# Altium schematic sheet Multiplier_x5.SchDoc
size A4; SheetNumber: 12; SheetTotal: 12
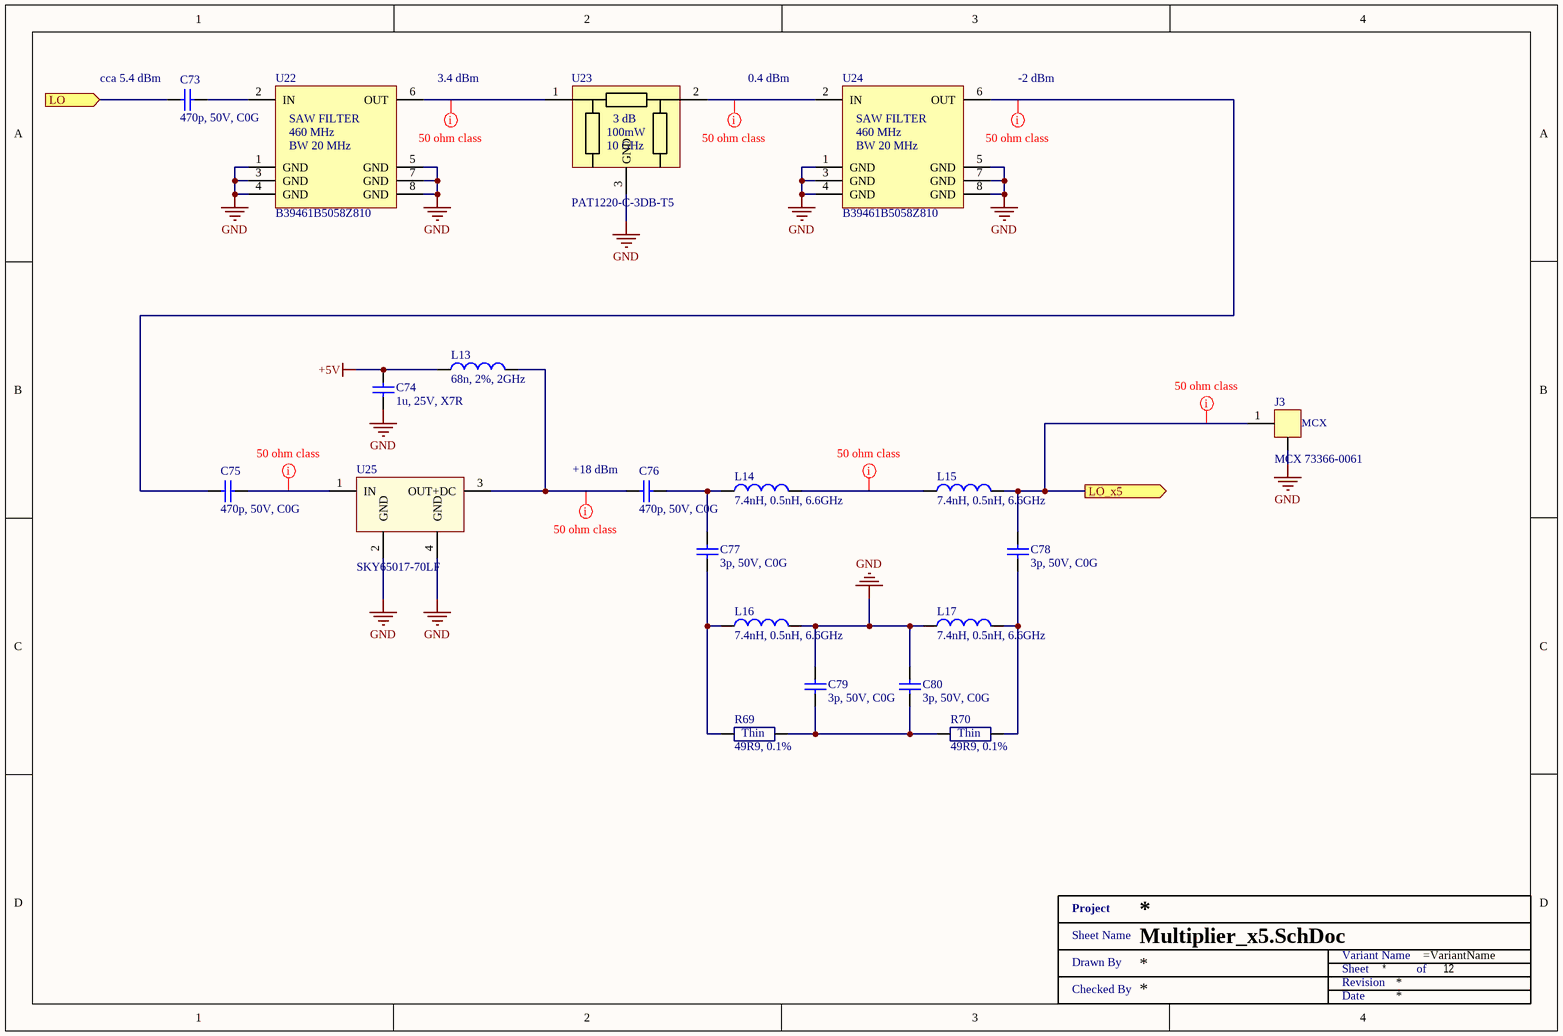
[diagram p0: Multiplier_x5.SchDoc]

## Parts
C73  470p, 50V, C0G  [SMD0603]
C74  1u, 25V, X7R  [SMD0603]
C75  470p, 50V, C0G  [SMD0603]
C76  470p, 50V, C0G  [SMD0603]
C77  3p, 50V, C0G  [SMD0402]
C78  3p, 50V, C0G  [SMD0402]
C79  3p, 50V, C0G  [SMD0402]
C80  3p, 50V, C0G  [SMD0402]
J3  MCX 73366-0061  [73366-0061]
L13  68n, 2%, 2GHz  [SMD0603 - L]
L14  7.4nH, 0.5nH, 6.6GHz  [Coilcraft-0402DC]
L15  7.4nH, 0.5nH, 6.6GHz  [Coilcraft-0402DC]
L16  7.4nH, 0.5nH, 6.6GHz  [Coilcraft-0402DC]
L17  7.4nH, 0.5nH, 6.6GHz  [Coilcraft-0402DC]
R69  49R9, 0.1%  [SMD0402 - R]
R70  49R9, 0.1%  [SMD0402 - R]
U22  B39461B5058Z810  [QCC8B]
U23  PAT1220-C-3DB-T5  [PAT1220]
U24  B39461B5058Z810  [QCC8B]
U25  SKY65017-70LF  [SOT89]
XX?  Title 1  (value not drawn)  (graphical)

## Ports
LO (in), LO_x5 (out)

## Nets
+5V: C74.2 L13.1
GND: C74.1 C79.2 C80.2 J3.2(GND) L16.2 L17.1 U22.1(GND) U22.3(GND) U22.4(GND) U22.5(GND) U22.7(GND) U22.8(GND) U23.3(GND) U24.1(GND) U24.3(GND) U24.4(GND) U24.5(GND) U24.7(GND) U24.8(GND) U25.2(GND) U25.4(GND)
LO: C73.1 ; port LO
LO_x5: C78.2 J3.1(INPUT) L15.2 ; port LO_x5
NetC73_2: C73.2 U22.2(IN)
NetC75_1: C75.1 U24.6(OUT)
NetC75_2: C75.2 U25.1(IN)
NetC76_1: C76.1 L13.2 U25.3(OUT+DC)
NetC76_2: C76.2 C77.2 L14.1
NetC77_1: C77.1 L16.1 R69.1
NetC78_1: C78.1 L17.2 R70.2
NetC79_1: C79.1 C80.1 R69.2 R70.1
NetL14_2: L14.2 L15.1
NetU22_6: U22.6(OUT) U23.1
NetU23_2: U23.2 U24.2(IN)

## Layout directives
net class 50 ohm: LO_x5, NetC75_1, NetC75_2, NetC76_1, NetL14_2, NetU22_6, NetU23_2

## Notes on the sheet
- (near C73) cca 5.4 dBm
- (near U22) 3.4 dBm
- 0.4 dBm
- -2 dBm
- (near C76) +18 dBm
- (in symbol AT0402BRD0749R9L) Thin
- (in symbol B39461B5058Z810) SAW FILTER; 460 MHz; BW 20 MHz
- (in symbol PAT1220-C-3DB-T5) 3 dB; 10 GHz
- (in symbol Title 1) Project; Sheet Name; Variant Name; Drawn By; Sheet; of; Revision; Checked By; Date

## Library data of the parts
C73 C75 C76 = GCM1885C1H471JA16D: MURATA - GCM1885C1H471JA16D - CAP, MLCC, C0G/NP0, 470PF, 50V, 0603; Ceramic Capacitor Case: 0603 [1608 Metric]; Voltage Rating: 50; Capacitance Tolerance: ± 5%; Product Range: GCM Series; SVHC: No SVHC (17-Dec-2015)<!--FANDB--><div class="features-and-benefits-container"><div class="features-and-benefits-desc-container"><span class="features-and-benefits-container-desc">SMD Multilayer Ceramic Capacitor, 0603 [1608 Metric], 470 pF, 50 V, ± 5%, C0G / NP0, GCM Series</span></div><div class="features-and-benefits-description"><span class="features-benefits-value">The GCM series capacitors from Murata are automotive grade multilayer ceramic chip capacitors (MLCC) used for automotive applications such as power train and safety equipment. The safety equipment includes drive system control, air bags and ABS of engine ECU. These MLCC capacitors are classified into temperature compensating and high dielectric constant types depending on the change in electrostatic capacitance due to change in temperature. The temperature compensating capacitors feature a small rate of change in electrostatic capacitance as the temperature changes. The high dielectric constant capacitors use materials with a high dielectric constant and feature a large electrostatic capacitance.</span></div><div class="features-and-benefits-list"><ul class="features-and-benefits-list-list"><li class="features-and-benefits-list-item">Capacitance values ranges from 0.1pF to 47?F</li><li class="features-and-benefits-list-item">Large capacity and small size in a multilayer structure</li><li class="features-and-benefits-list-item">Tin plated external electrodes, excellent solderability</li><li class="features-and-benefits-list-item">Capacitor size varies from 0.6mm x 0.3mm to 5.7mm x 5.0mm</li><li class="features-and-benefits-list-item">Voltage rating ranges from 6.3VDC to 1000VDC</li><li class="features-and-benefits-list-item">Temperature characteristics are classified according to JIS and EIA standard</li><li class="features-and-benefits-list-item">Operating temperature changes according to temperature coefficient of capacitor</li><li class="features-and-benefits-list-item">Automotive grade AEC-Q200 qualified</li></ul></div><div class="features-and-benefits-applications"><ul class="features-and-benefits-value"><li class="features-and-benefits-list-item">Industrial</li><li class="features-and-benefits-list-item">Consumer Electronics</li><li class="features-and-benefits-list-item">Portable Devices</li><li class="features-and-benefits-list-item">Power Management</li><li class="features-and-benefits-list-item">Safety</li><li class="features-and-benefits-list-item">Automotive</li></ul></div></div>; Supplier 1: Farnell; Supplier Part Number 1: 2494192; Manufacturer: MURATA; Manufacturer Part Number: GCM1885C1H471JA16D; RoHS: YES; Stock 1: 10240; Pricing 1: 10=0.0277, 100=0.0184, 500=0.0139, 1000=0.0111, 2000=0.0103, 4000=0.0091, 20000=0.0077, 40000=0.0071 (GBP); Capacitance: 470p; Dielectric Characteristic: C0G / NP0; Packaging: Cut Tape; Operating Temperature Min: -55; Operating Temperature Max: 125; Automotive Qualification Standard: -; MSL: MSL 6 - Time on Label; ComponentLink1URL: http://www.farnell.com/datasheets/1955642.pdf; ComponentLink1Description: http://www.farnell.com/datasheets/1955642.pdf; Supplier 2: Digi-Key; Supplier Part Number 2: 490-4965-1-ND
C74 = CGA3E1X7R1E105K080AC: CAP CER 1UF 25V X7R 0603; Manufacturer: TDK Corporation; Tolerance: ±10%; Manufacturer Part Number: CGA3E1X7R1E105K080AC; RoHS: RoHS Compliant; Category: Capacitors; Stock 1: 109509; Pricing 1: 1=0.2, 10=0.135, 100=0.0686, 500=0.04696, 1000=0.04154 (USD); Packaging: Cut Tape (CT); Part Status: Active; Voltage - Rated: 25V; Temperature Coefficient: X7R; Operating Temperature: -55°C ~ 125°C; Features: -; Ratings: AEC-Q200; Applications: Automotive; Failure Rate: -; Mounting Type: Surface Mount, MLCC; Package / Case: 0603 (1608 Metric); Size / Dimension: 0.063" L x 0.032" W (1.60mm x 0.80mm); Height - Seated (Max): -; Thickness (Max): 0.035" (0.90mm); Lead Spacing: -; Lead Style: -; ComponentLink1URL: https://product.tdk.com/info/en/catalog/datasheets/mlcc_automotive_general_en.pdf; ComponentLink1Description: https://product.tdk.com/info/en/catalog/datasheets/mlcc_automotive_general_en.pdf; Capacitance: 1u; Supplier 1: Mouser; Supplier Part Number 1: 810-CGA3E1X7R1E105K; Supplier 2: Farnell; Supplier Part Number 2: 2346962; Supplier 3: Digi-Key; Supplier Part Number 3: 445-6931-1-ND
C77-C80 = GJM1555C1H3R0WB01D: CAP CER 3PF 50V C0G/NP0 0402; Manufacturer: Murata; Supplier 1: Mouser; Supplier Part Number 1: 81-GJM1555C1H3R0WB1D; Manufacturer Part Number: GJM1555C1H3R0WB01D; RoHS: Yes; Category: Ceramic Capacitors; Stock 1: 79370; Pricing 1: 1=0.27000, 10=0.18500, 50=0.18500, 100=0.10500, 500=0.07400, 1000=0.06500, 2500=0.06200, 5000=0.05700, 10000=0.04700 (USD); Mount: Surface Mount; Case/Package: 0402; Case Code (Imperial): 0402; Case Code (Metric): 1005; Min Operating Temperature: -55°C; Max Operating Temperature: 125°C; Capacitance: 3pF; Package Quantity: 10000; Packaging: Tape and Reel; Voltage Rating: 50V; Dielectric: C0G; Voltage Rating (DC): 50V; Termination: SMD/SMT; Series: GJM; Construction: Flat; Length: 1mm; Width: 0.5mm; Height: 0.5mm; Thickness: 0.022inch; Depth: 0.5mm; Radiation Hardening: No; RoHS Compliant: Yes; ComponentLink1URL: http://www.mouser.com/ds/2/281/c02e-2905.pdf?src-supplier=Mouser; ComponentLink1Description: http://www.mouser.com/ds/2/281/c02e-2905.pdf?src-supplier=Mouser; ComponentLink2URL: http://search.murata.co.jp/Ceramy/image/img/PDF/ENG/GJM1555C1H3R0WB01.pdf?src-supplier=Avnet; ComponentLink2Description: http://search.murata.co.jp/Ceramy/image/img/PDF/ENG/GJM1555C1H3R0WB01.pdf?src-supplier=Avnet; ComponentLink3URL: http://search.murata.co.jp/Ceramy/image/img/A01X/G101/ENG/GJM1555C1H3R0WB01-01.pdf?src-supplier=Digi-Key; ComponentLink3Description: http://search.murata.co.jp/Ceramy/image/img/A01X/G101/ENG/GJM1555C1H3R0WB01-01.pdf?src-supplier=Digi-Key; ComponentLink4URL: http://search.murata.co.jp/Ceramy/image/img/A01X/partnumbering_e_01.pdf?src-supplier=Digi-Key; ComponentLink4Description: http://search.murata.co.jp/Ceramy/image/img/A01X/partnumbering_e_01.pdf?src-supplier=Digi-Key; ComponentLink5URL: http://components.arrow.com/part/dataview/46522145S277297N2606?src-supplier=Arrow+Electronics; ComponentLink5Description: http://components.arrow.com/part/dataview/46522145S277297N2606?src-supplier=Arrow+Electronics; Supplier 2: Farnell; Supplier Part Number 2: 3243232; Supplier 3: Digi-Key; Supplier Part Number 3: 490-11211-1-ND; Supplier 4: RSComponents; Supplier Part Number 4: 1853162
J3 = 73366-0061: CONN MCX JACK STR 50 OHM PCB; Manufacturer: Molex, LLC; Manufacturer Part Number: 0733660061; Connector Type: Jack, Female Socket; Contact Termination: Solder; Impedance: 50 Ohm; Body Material: Brass; Body Finish: Gold; Dielectric Material: Polytetrafluoroethylene (PTFE); Center Contact Material: Beryllium Copper; Mating Cycles: 500; RoHS: RoHS Compliant; Category: Connectors, Interconnects; Stock 1: 39394; Pricing 1: 1=1.95, 10=1.765, 25=1.6572, 50=1.5854, 100=1.5133, 250=1.36916, 500=1.26106, 1000=1.0809, 2500=1.00884 (USD); Packaging: Tray; Part Status: Active; Connector Style: MCX; Shield Termination: Solder; Mounting Type: Through Hole; Mounting Feature: -; Cable Group: -; Fastening Type: Snap-On; Features: -; Housing Color: Gold; Ingress Protection: -; Includes: -; Center Contact Plating: Gold; Operating Temperature: -55°C ~ 155°C; Insertion Loss: -; ComponentLink1URL: https://www.molex.com/pdm_docs/sd/733660061_sd.pdf; ComponentLink1Description: https://www.molex.com/pdm_docs/sd/733660061_sd.pdf; Supplier 1: Mouser; Supplier Part Number 1: 538-73366-0061; Supplier 2: Digi-Key; Supplier Part Number 2: WM5541-ND; Supplier 3: Farnell; Supplier Part Number 3: 1909245
L13 = 0603HP-68NXGLU: Fixed Inductors 0603HP Hi Perfrmnce 68 nH 2 % 0.6 A; Manufacturer: Coilcraft; Core Material: Ceramic; Q Factor: 49; Max DC Current: 600mA; DC Resistance (DCR): 330mR; Test Frequency: 200MHz; Supplier 1: Mouser; Supplier Part Number 1: 994-0603HP-68NXGLU; Manufacturer Part Number: 0603HP-68NXGLU; Stock 1: 2486; Pricing 1: 1=1.18000, 10=1.18000, 50=1.18000, 100=1.18000, 200=0.89000, 500=0.66000 (USD); RoHS: Yes; Mount: Surface Mount; Case/Package: 0603; Case Code (Metric): 1608; Case Code (Imperial): 0603; Min Operating Temperature: -40°C; Max Operating Temperature: 125°C; Packaging: Tape and Reel; Package Quantity: 100; Tolerance: 2%; Inductance: 68n; Self Resonant Frequency: 2GHz; Termination: SMD/SMT; Inductance Tolerance: 2%; Current Rating: 600mA; Length: 1.75mm; Height: 0.94mm; Width: 1.09mm; Lead Free: Contains Lead; REACH SVHC: No SVHC; ComponentLink1URL: https://datasheet.ciiva.com/22709/1681881-22709625.pdf?src-supplier=Element14; ComponentLink1Description: https://datasheet.ciiva.com/22709/1681881-22709625.pdf?src-supplier=Element14; Supplier 2: Farnell; Supplier Part Number 2: 2286163
L14-L17 = LQW15AN7N4D10D: Ind Chip Wirewound 7.4nH 0.5nH 0402 Paper T/R; Manufacturer: Murata; Supplier 1: Mouser; Supplier Part Number 1: 81-LQW15AN7N4D10D; Manufacturer Part Number: LQW15AN7N4D10D; Category: Fixed Inductors; Stock 1: 9490; Pricing 1: 1=0.21000, 10=0.17900, 50=0.17900, 100=0.11900, 1000=0.08300, 10000=0.05700 (USD); ComponentLink1URL: https://datasheet.octopart.com/LQW15AN7N4D10D-Murata-datasheet-138758294.pdf?src-supplier=Ciiva+Crawler; ComponentLink1Description: https://datasheet.octopart.com/LQW15AN7N4D10D-Murata-datasheet-138758294.pdf?src-supplier=Ciiva+Crawler; ComponentLink2URL: https://datasheet.octopart.com/LQW15AN7N4D10D-Murata-datasheet-140717249.pdf?src-supplier=Ciiva+Crawler; ComponentLink2Description: https://datasheet.octopart.com/LQW15AN7N4D10D-Murata-datasheet-140717249.pdf?src-supplier=Ciiva+Crawler; ComponentLink3URL: https://datasheet.octopart.com/LQW15AN7N4D10D-Murata-datasheet-141294512.pdf?src-supplier=Ciiva+Crawler; ComponentLink3Description: https://datasheet.octopart.com/LQW15AN7N4D10D-Murata-datasheet-141294512.pdf?src-supplier=Ciiva+Crawler; ComponentLink4URL: https://datasheet.octopart.com/LQW15AN7N4D10D-Murata-datasheet-142541909.pdf?src-supplier=Ciiva+Crawler; ComponentLink4Description: https://datasheet.octopart.com/LQW15AN7N4D10D-Murata-datasheet-142541909.pdf?src-supplier=Ciiva+Crawler; ComponentLink5URL: https://datasheet.octopart.com/LQW15AN7N4D10D-Murata-datasheet-140317909.pdf?src-supplier=Farnell; ComponentLink5Description: https://datasheet.octopart.com/LQW15AN7N4D10D-Murata-datasheet-140317909.pdf?src-supplier=Farnell; ComponentLink6URL: https://datasheet.octopart.com/LQW15AN7N4D10D-Murata-datasheet-145452064.pdf?src-supplier=Geoflip; ComponentLink6Description: https://datasheet.octopart.com/LQW15AN7N4D10D-Murata-datasheet-145452064.pdf?src-supplier=Geoflip; Supplier 2: Farnell; Supplier Part Number 2: 3356519; Supplier 3: Digi-Key; Supplier Part Number 3: 490-LQW15AN7N4D10DTR-ND
R69 R70 = AT0402BRD0749R9L: Thin Film Resistors - SMD 49.9 Ohms 0.1% Tol. AEC-Q200; Manufacturer: Yageo; Power Rating: 62.5 mW (1/16 W); Temperature Coefficient: 25 PPM / C; Voltage Rating: 50 V; CNHTS: 8533211000; MXHTS: 85332101; TARIC: 8533210000; Supplier 1: Mouser; Supplier Part Number 1: 603-AT0402BRD0749R9L; Manufacturer Part Number: AT0402BRD0749R9L; RoHS: RoHS Compliant; Category: Thin Film Resistors - SMD; Stock 1: 9662; Pricing 1: 1=0.594, 10=0.346, 100=0.139, 1000=0.106, 2500=0.081, 10000=0.079, 20000=0.077 (EUR); Diameter: -; Features: -; Height: 0.3 mm; Length: 1 mm; Operating Temperature Range: - 55 C to + 125 C; Package / Case: 0402 (1005 metric); Packaging: Cut Tape; Product: Thin Film Resistors SMD; Resistance: 49.9 Ohms; Series: AT; Termination Style: SMD/SMT; Tolerance: 0.1 %; Type: High Precision High Stability Chip Resistors; Width: 0.5 mm; Brand: Yageo; Mounting Style: PCB Mount; Case Code - in: 0402; Case Code - mm: 1005; HTS Code: 8533210030; Maximum Operating Temperature: + 125 C; Minimum Operating Temperature: - 55 C; Product Type: Thin Film Resistors; Qualification: AEC-Q200; Standard Pack Qty: 10000; Subcategory: Resistors; RoHS - Mouser: Y; Minimum Order Quantity: 1; Reeling: True; ComponentLink1URL: http://www.mouser.com/datasheet/2/447/PYu-AT_51_RoHS_L_5-1222714.pdf; ComponentLink1Description: http://www.mouser.com/datasheet/2/447/PYu-AT_51_RoHS_L_5-1222714.pdf
U22 U24 = B39461B5058Z810: SAW Filter 460MHzFrequency 50Ohm SMD 8Pin QCC8B; Manufacturer: RF360 Holdings; Supplier 1: Mouser; Supplier Part Number 1: 871-B39461B5058Z810; Manufacturer Part Number: B39461B5058Z810; RoHS: No; Category: EMI / RFI Components; Stock 1: 2625; Pricing 1: 1=2.87000, 10=2.77000, 50=2.77000, 100=1.77000, 1000=1.46000, 10000=1.19000 (USD)
U23 = PAT1220-C-3DB-T5: Chip Attenuator 10GHz 3dB, 100mW; Manufacturer: Susumu; Impedance: 50R; Supplier 1: Mouser; Supplier Part Number 1: 754-PAT1220C-3DBT5; Manufacturer Part Number: PAT1220-C-3DB-T5; RoHS: Yes; Category: Uncategorized; Stock 1: 8775; Pricing 1: 1=0.35000, 10=0.30800, 25=0.27800, 100=0.24300, 250=0.21300, 500=0.18800, 1000=0.14800, 5000=0.12500, 10000=0.12000 (USD); Mount: Surface Mount; Case/Package: 0805; Number of Pins: 3; Case Code (Imperial): 0805; Case Code (Metric): 2012; Package Quantity: 1; Packaging: Tape and Reel; Attenuation Value: 3dB; Max Power Dissipation: 100mW; Power Rating: 100mW; Resistance: 50R; Lead Free: Lead Free; ComponentLink1URL: https://datasheet.ciiva.com/15101/getdatasheetpartid-506219-15101145.pdf?src-supplier=Verical; ComponentLink1Description: https://datasheet.ciiva.com/15101/getdatasheetpartid-506219-15101145.pdf?src-supplier=Verical; ComponentLink2URL: https://datasheet.ciiva.com/2788/products-38-2788365.pdf?src-supplier=Digi-Key; ComponentLink2Description: https://datasheet.ciiva.com/2788/products-38-2788365.pdf?src-supplier=Digi-Key; ComponentLink3URL: https://datasheet.ciiva.com/2788/products-38-2788366.pdf?src-supplier=Digi-Key; ComponentLink3Description: https://datasheet.ciiva.com/2788/products-38-2788366.pdf?src-supplier=Digi-Key; ComponentLink4URL: https://datasheet.ciiva.com/2788/products-38-2788367.pdf?src-supplier=Digi-Key; ComponentLink4Description: https://datasheet.ciiva.com/2788/products-38-2788367.pdf?src-supplier=Digi-Key; ComponentLink5URL: https://datasheet.ciiva.com/17406/products-38-17406815.pdf?src-supplier=Future+Electronics; ComponentLink5Description: https://datasheet.ciiva.com/17406/products-38-17406815.pdf?src-supplier=Future+Electronics
U25 = SKY65017-70LF: IC AMP INGAP LF-6GHZ SOT-89; Manufacturer: Skyworks Solutions Inc.; Frequency: 0.1Hz ~ 6GHz; P1dB: 20dBm (100mW); Gain: 20dB; Noise Figure: 5dB; RF Type: DBS, HLAN, WLAN; Voltage - Supply: 4.5 V ~ 5.5 V; Current - Supply: 120mA; Test Frequency: 2GHz; Manufacturer Part Number: SKY65017-70LF; RoHS: RoHS Compliant; Category: RF/IF and RFID; Stock 1: 6721; Pricing 1: 1=3, 10=2.683, 25=2.4144, 100=2.1999, 250=1.98524, 500=1.78134 (USD); Packaging: Cut Tape (CT); Part Status: Active; Package / Case: TO-243AA; Supplier Device Package: SOT-89-3; ComponentLink1URL: http://www.skyworksinc.com/uploads/documents/SKY65017_70LF_200528G.pdf; ComponentLink1Description: http://www.skyworksinc.com/uploads/documents/SKY65017_70LF_200528G.pdf; Supplier 1: Mouser; Supplier Part Number 1: 873-SKY65017-70LF; Supplier 2: Digi-Key; Supplier Part Number 2: 863-1063-1-ND